# Altium schematic sheet 1_BTB.SchDoc
size A4; SheetNumber: 1; SheetTotal: 4
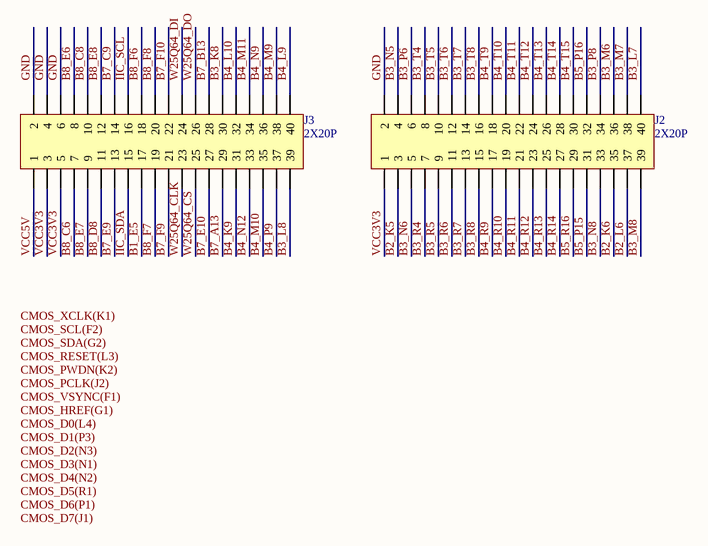
[diagram p0: 1_BTB.SchDoc]

## Parts
J2  2X20P  [HEAD_2X20P]
J3  2X20P  [HEAD_2X20P]

## Nets
B1_E5: J3.17
B2_K5: J2.3
B2_K6: J2.35
B2_L6: J2.37
B3_K8: J3.30
B3_L7: J2.40
B3_L8: J3.39
B3_M6: J2.36
B3_M7: J2.38
B3_M8: J2.39
B3_N5: J2.4
B3_N6: J2.5
B3_N8: J2.33
B3_P6: J2.6
B3_P8: J2.34
B3_R4: J2.7
B3_R5: J2.9
B3_R6: J2.11
B3_R7: J2.13
B3_R8: J2.15
B3_T4: J2.8
B3_T5: J2.10
B3_T6: J2.12
B3_T7: J2.14
B3_T8: J2.16
B4_K9: J3.31
B4_L9: J3.40
B4_L10: J3.32
B4_M9: J3.38
B4_M10: J3.35
B4_M11: J3.34
B4_N9: J3.36
B4_N12: J3.33
B4_P9: J3.37
B4_R9: J2.17
B4_R10: J2.19
B4_R11: J2.21
B4_R12: J2.23
B4_R13: J2.25
B4_R14: J2.27
B4_T9: J2.18
B4_T10: J2.20
B4_T11: J2.22
B4_T12: J2.24
B4_T13: J2.26
B4_T14: J2.28
B4_T15: J2.30
B5_P15: J2.31
B5_P16: J2.32
B5_R16: J2.29
B7_A13: J3.29
B7_B13: J3.28
B7_C9: J3.14
B7_E9: J3.13
B7_E10: J3.27
B7_F9: J3.21
B7_F10: J3.22
B8_C6: J3.7
B8_C8: J3.10
B8_D8: J3.11
B8_E6: J3.8
B8_E7: J3.9
B8_E8: J3.12
B8_F6: J3.18
B8_F7: J3.19
B8_F8: J3.20
GND: J2.2 J3.2 J3.4 J3.6
IIC_SCL: J3.16
IIC_SDA: J3.15
VCC3V3: J2.1 J3.3 J3.5
VCC5V: J3.1
W25Q64_CLK: J3.23
W25Q64_CS: J3.25
W25Q64_DI: J3.24
W25Q64_DO: J3.26

## Notes on the sheet
- Labels drawn without touching a wire or pin: CMOS_D0(L4), CMOS_D1(P3), CMOS_D2(N3), CMOS_D3(N1), CMOS_D4(N2), CMOS_D5(R1), CMOS_D6(P1), CMOS_D7(J1), CMOS_HREF(G1), CMOS_PCLK(J2), CMOS_PWDN(K2), CMOS_RESET(L3), CMOS_SCL(F2), CMOS_SDA(G2), CMOS_VSYNC(F1), CMOS_XCLK(K1)